# EAGLE schematic emitter follower (EAGLE 9.6.2)
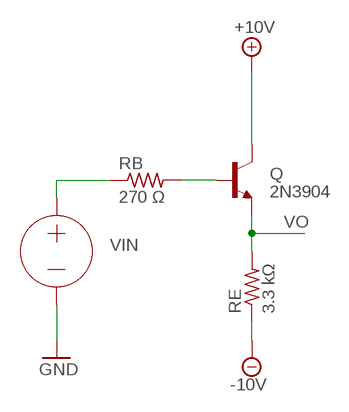
[diagram p0: schematic, sheet 1]

## Parts
Q  2N3904  [TO92]
RB  270 Ω  R-US_0204/5  [0204/5]
RE  3.3 kΩ  R-US_0204/5  [0204/5]
VIN  0V  VOLTAGE  (no package)

## Nets
+10V: Q.1(C)
-10V: RE.1
GND: VIN.-
N$2: Q.2(B) RB.2
N$3: RB.1 VIN.+
VO: Q.3(E) RE.2

## Library data of the parts
Q = transistor:2N3904: NPN TRANSISTOR
RB RE = rcl:R-US_: RESISTOR, American symbol; SPICEPREFIX: R
VIN = ngspice-simulation:VOLTAGE: Independent Voltage Source, either DC, AC, PULSE, SINE, PWL, EXP, or SFFM